# EAGLE design BBRegulator (EAGLE 5.11)
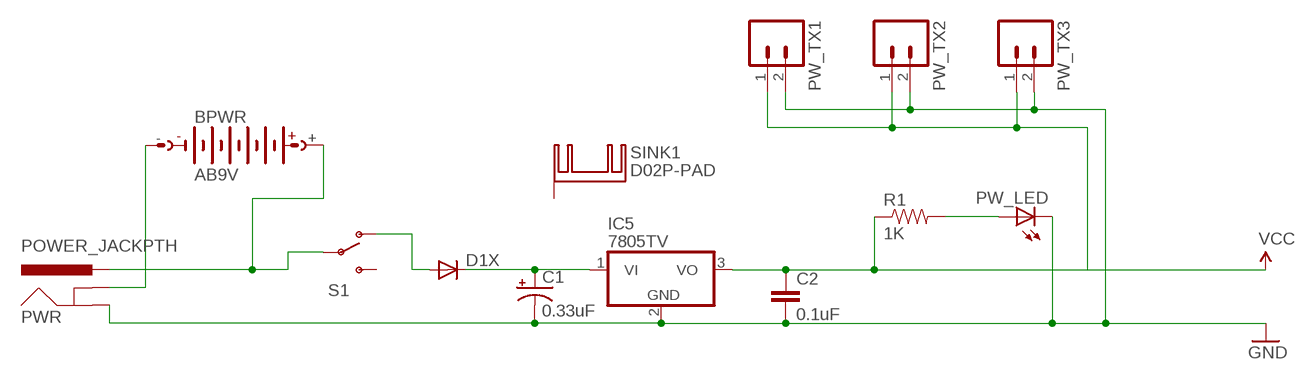
[diagram p0: schematic, sheet 1]

## Parts
BPWR  AB9V  [AB9V]
C1  0.33uF  CAP_POLPTH1  [CPOL-RADIAL-100UF-25V]
C2  0.1uF  CAPPTH  [CAP-PTH-SMALL]
D1X  DIODEPTH  [DIODE-1N4001]
IC5  7805TV  [TO220V]
PW_LED  LED3MM  [LED3MM]
PW_TX1  M02LOCK  [1X02_LOCK]
PW_TX2  M02LOCK  [1X02_LOCK]
PW_TX3  M02LOCK  [1X02_LOCK]
PWR  POWER_JACKPTH  [POWER_JACK_PTH]
R1  1K  RESISTORPTH-1/4W  [AXIAL-0.4]
S1  SWITCH-SPSTPTH  [SWITCH-SPDT]
SINK1  D02P-PAD  [D02PA-PAD]

## Nets
GND: C1.2(-) C2.2 IC5.2(GND) PW_LED.K(C) PW_TX1.2 PW_TX2.2 PW_TX3.2 PWR.GND
N$1: D1X.A S1.1(O)
N$2: PW_LED.A R1.P$2
N$6: BPWR.+ PWR.PWR S1.2(P)
N$10: C1.1(+) D1X.C IC5.1(VI)
N$31: BPWR.- PWR.GNDBREAK
VCC: C2.1 IC5.3(VO) PW_TX1.1 PW_TX2.1 PW_TX3.1 R1.P$1
Unconnected: S1.3(S) SINK1.B(K)

## Library data of the parts
BPWR = battery:AB9V: 9-V BATTERY CLIP
C1 = SparkFun:CAP_POL: Capacitor Polarized These are standard SMD and PTH capacitors. Normally 10uF, 47uF, and 100uF in electrolytic and tantalum varieties. Always verify the external diameter of the through hole cap, it varies with capacity, voltage, and manufacturer. The EIA devices should be standard.
C2 = SparkFun:CAP: Capacitor Standard 0603 ceramic capacitor, and 0.1" leaded capacitor.
D1X = SparkFun:DIODE: Diode These are standard reverse protection diodes and small signal diodes. SMA package can handle up to about 1A. SOD-323 can handle about 200mA. What the SOD-323 package when ordering, there are some mfgs out there that are 5-pin packages.
IC5 = linear:78*: Positive VOLTAGE REGULATOR Source: http://cache.national.com/ds/LM/LM78L05.pdf http://www.fairchildsemi.com/ds/LM/LM7805.pdf
PW_LED = SparkFun:LED: LEDs Standard schematic elements and footprints for 5mm, 3mm, 1206, and 0603 sized LEDs. 5mm - Spark Fun Electronics SKU : COM-00529 (and others)
PW_TX1-PW_TX3 = SparkFun:M02: Header 2 Standard 2-pin 0.1" header. Use with straight break away headers (SKU : PRT-00116), right angle break away headers (PRT-00553), swiss pins (PRT-00743), machine pins (PRT-00117), and female headers (PRT-00115). Molex polarized connector foot print use with SKU : PRT-08233 with associated crimp pins and housings.
PWR = SparkFun:POWER_JACK: Power Jack This is the standard 5.5mm barrel jack for power. The PTH is the most common, proven, reliable, footprint. All others are experimental. The Slot footprint only works if the mill layer is transmitted to the PCB fab house so be warned. Spark Fun Electronics SKU : PRT-00119. Mating wall wart : TOL-00298 (and others)
R1 = SparkFun:RESISTOR: Resistor Basic schematic elements and footprints for 0603, 1206, and PTH resistors.
S1 = SparkFun:SWITCH-SPST: SPST Switch Simple slide switch. Spark Fun Electronics SKU : COM-00102
SINK1 = heatsink:D02P-PAD: HEATSINK distributor Schukat

## Board
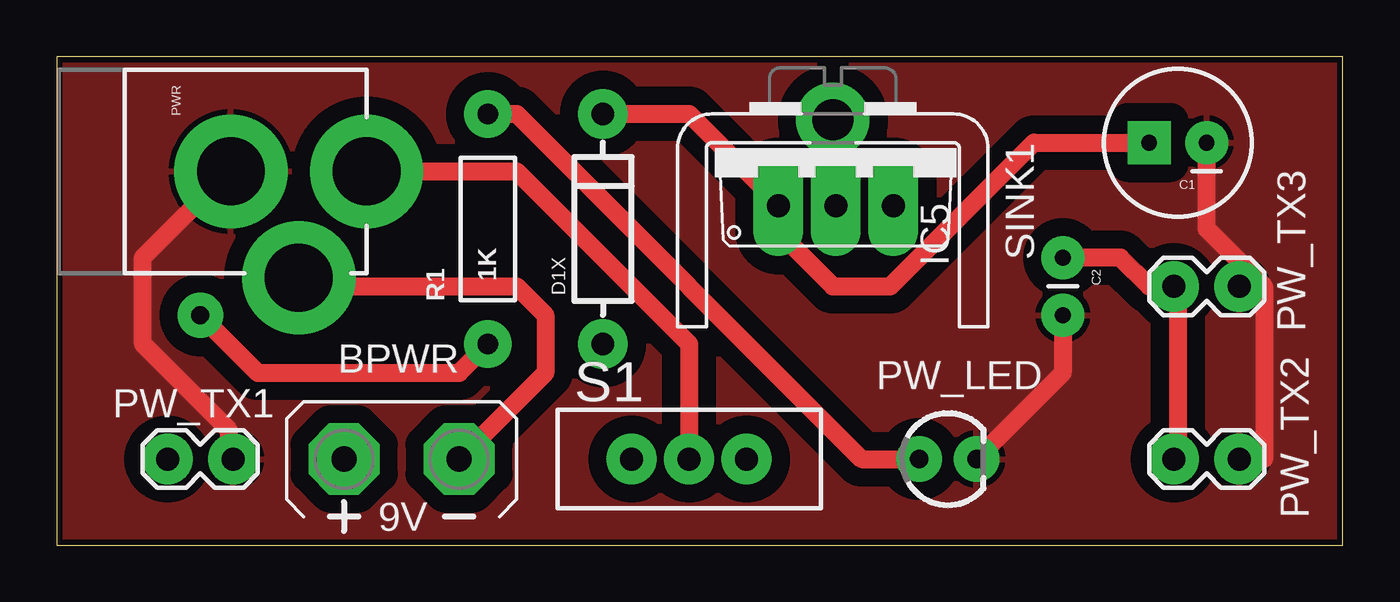
[diagram p1: board, top side]
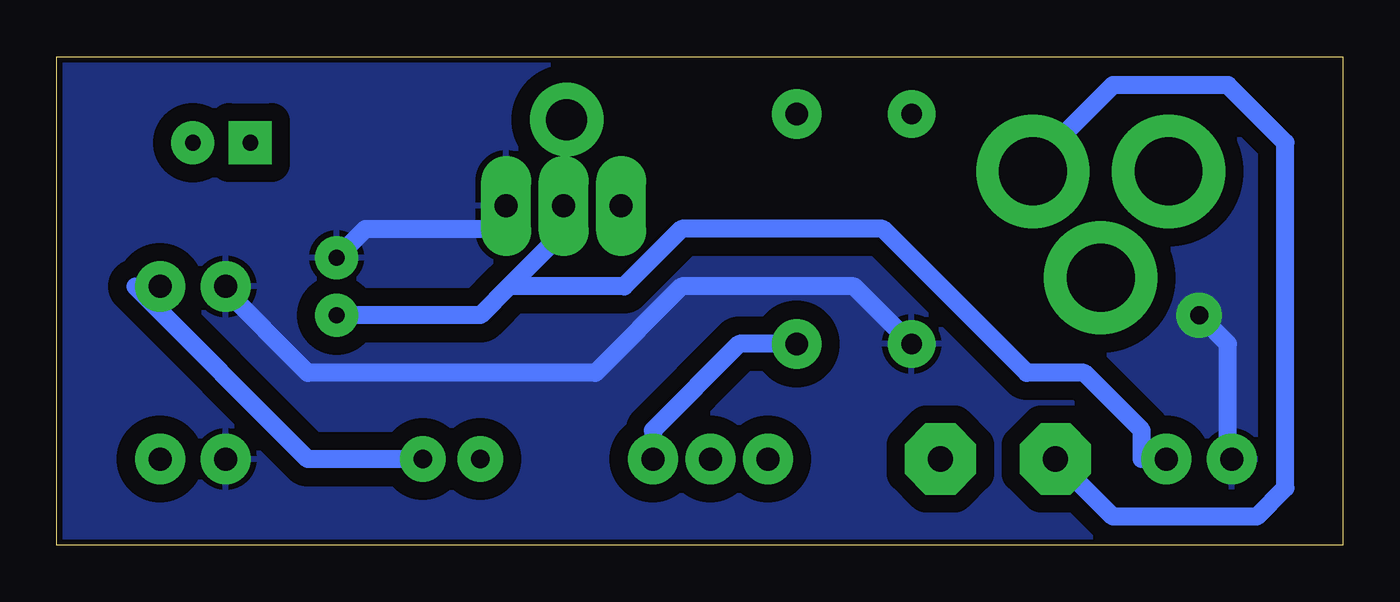
[diagram p2: board, bottom side, seen from below]

Size 56.82 x 21.58 mm. Coordinates in mm from the lower left corner, seen from the top.
Outline: 0,0 56.82,0 56.82,21.58 0,21.58 0,0
Copper layers (1*16): Top 0.035mm / dielectric 1.5mm / Bottom 0.035mm
Design rules "hobby": minimum track width 0.8mm, minimum drill 0.8mm, track to track 0.8mm, track to pad 0.8mm, pad to pad 0.45mm, via to via 0.8mm, smd to smd 8mil, copper to edge 10mil, drill to drill 8mil, minimum pad ring 0.6mm, minimum via ring 0.6mm, stop-mask expansion 4mil, vias tented up to drill 25mil, thermal gap 10mil

### Footprints (pad centres in the part's own frame; a part is rotated, then mirrored left to right if it is on the bottom)
AB9V = drill 1.118 pad 3.15 octagon: + 0,2.54; - 0,-2.54
CPOL-RADIAL-100UF-25V = drill 0.7 pad 1.651 square: 1 1.27,0 | drill 0.7 pad 1.651 round: 2 -1.27,0
CAP-PTH-SMALL = drill 0.7 pad 1.651 round: 1 0,0; 2 2.54,0
DIODE-1N4001 = drill 1 pad 1.981 round: A -5.08,0; C 5.08,0
TO220V = drill 1.016 long: 1 -2.54,-2.54; 2 0,-2.54; 3 2.54,-2.54
LED3MM = drill 0.813 pad 1.88 round: A -1.27,0; K 1.27,0
1X02_LOCK = drill 1.016 pad 1.88 round: 1 -0.178,0; 2 2.718,0
POWER_JACK_PTH = drill 2.997 pad 4.318 round: GND 0,7.7; GNDBREAK 4.7,10.7; PWR 0,13.7
AXIAL-0.4 = drill 0.9 pad 1.88 round: P$1 -5.08,0; P$2 5.08,0
SWITCH-SPDT = drill 1.016 pad 1.88 round: 1 0,2.54; 2 0,0; 3 0,-2.54
D02PA-PAD = drill 1.803 pad 2.54 round: B 0,-1.016

### Placement (x,y rotation side)
BPWR  15.24,3.81 90 top
C1  49.53,17.78 180 top
C2  44.45,12.7 270 top
D1X  24.13,13.97 90 top
IC5  34.42,17.53 0 top
PW_LED  39.37,3.81 0 top
PW_TX1  5.08,3.81 0 top
PW_TX2  49.53,3.81 0 top
PW_TX3  49.53,11.43 0 top
PWR  0,16.51 270 top
R1  19.05,13.97 90 top
S1  27.94,3.81 270 top
SINK1  34.29,17.78 180 top

### Tracks (layer width: path | path; a pad name or v marks a point on that pad's centre or on a via)
GND
  Top 0.8: PW_TX1.2 7.62,3.81 7.62,5.08 3.81,8.89 3.81,12.7 7.62,16.51 PWR.GND | C1.2 50.8,13.97 53.34,11.43 | 53.34,11.43 53.34,3.81 PW_TX2.2 | PW_TX3.2 53.34,11.43 | C2.2 44.45,7.62 PW_LED.K
  Bottom 0.8: 36.83,11.43 38.1,10.16 C2.2 | 36.83,11.43 34.29,13.97 IC5.2 | PW_LED.K 45.72,3.81 53.34,11.43 PW_TX3.2 | 36.83,11.43 31.75,11.43 29.21,13.97 20.32,13.97 13.97,7.62 11.43,7.62 8.89,5.08 8.89,3.81 PW_TX1.2
  pour Top: -1.27,22.86 57.15,22.86 57.15,-1.27 -1.27,-1.27
N$1
  Bottom 0.8: D1X.A 26.67,8.89 30.48,5.08 S1.1
N$2
  Top 0.8: PW_LED.A 35.56,3.81 20.32,19.05 R1.P$2
N$6
  Top 0.8: S1.2 27.94,8.89 20.32,16.51 PWR.PWR
  Bottom 0.8: BPWR.+ 10.16,1.27 3.81,1.27 2.54,2.54 2.54,17.78 5.08,20.32 10.16,20.32 13.97,16.51 PWR.PWR
N$10
  Top 0.8: C1.1 43.18,17.78 36.83,11.43 34.29,11.43 31.75,13.97 IC5.1 31.75,15.24 27.94,19.05 D1X.C
N$31
  Top 0.8: BPWR.- 21.59,7.62 21.59,10.16 20.32,11.43 11.43,11.43 PWR.GNDBREAK
VCC  (via drill 0.8)
  Top 0.8: C2.1 46.99,12.7 48.26,11.43 PW_TX3.1 49.53,11.43 49.53,3.81 PW_TX2.1 | v6.35,10.16 8.89,7.62 17.78,7.62 R1.P$1
  Bottom 0.8: R1.P$1 21.59,11.43 29.21,11.43 33.02,7.62 45.72,7.62 49.53,11.43 PW_TX3.1 | v6.35,10.16 5.08,8.89 5.08,3.81 PW_TX1.1 | C2.1 43.18,13.97 36.83,13.97 IC5.3
  pour Bottom: -1.27,22.86 57.15,22.86 57.15,-1.27 -1.27,-1.27

### Text on the board
_tsilk: + - | ON | + | + - | + -